# EAGLE design MEMS-preamp_v12 (EAGLE 8.5.0)

## Sheet 1 of 2
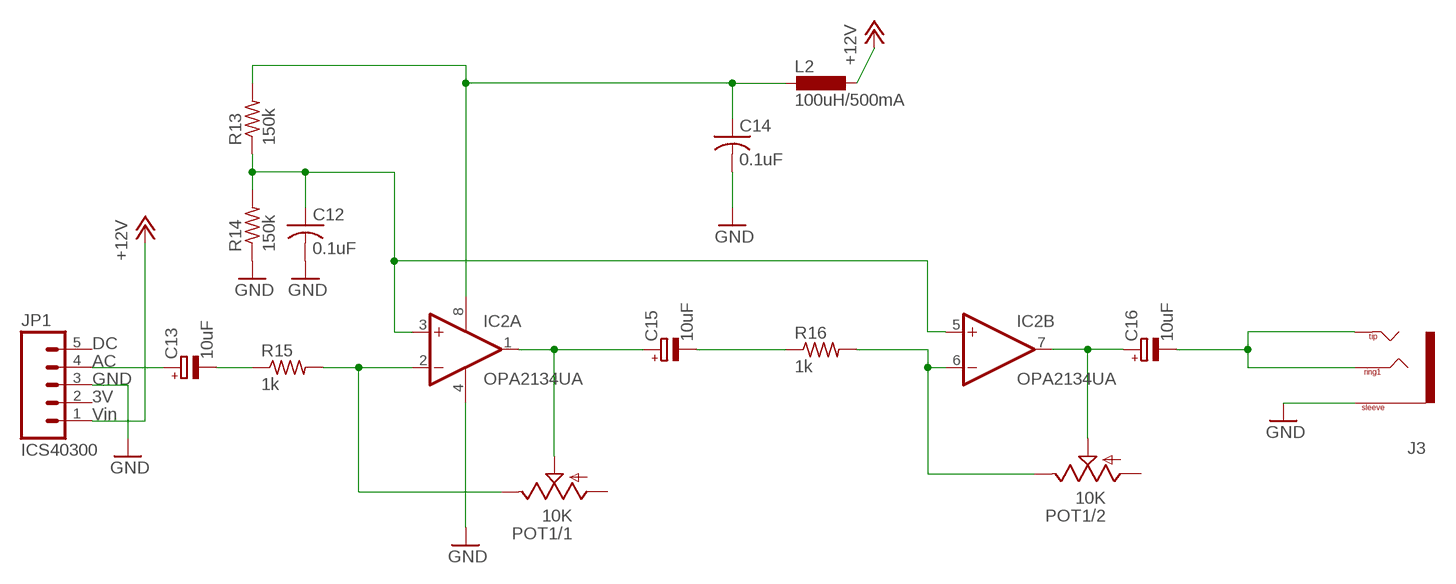
[diagram p0: schematic, sheet 1]

### Parts
C12  0.1uF  C-USC0805  [C0805]
C13  10uF  CPOL-EUB  [PANASONIC_B]
C14  0.1uF  C-USC0805K  [C0805K]
C15  10uF  CPOL-EUB  [PANASONIC_B]
C16  10uF  CPOL-EUB  [PANASONIC_B]
IC2  OPA2134UA  [SO08]
J3  TRS-1/8"-3.5MM  [TRS_SJ-3524-SMT]
JP1  ICS40300  M05LOCK  [1X05_LOCK]
L2  100uH/500mA  L-EUL3225M  [L3225M]
POT1  10K  POT-DUAL-PTV112-4420  [PTV112]
R13  150k  R-US_R0603  [R0603]
R14  150k  R-US_R0603  [R0603]
R15  1k  R-US_R0603  [R0603]
R16  1k  R-US_R0603  [R0603]

### Nets
+12V: JP1.1 L2.1 ; also sheet 2
GND: C12.2 C14.2 IC2.4(A:V-) J3.1(SLEEVE) JP1.3 R14.1 ; also sheet 2
N$3: C13.+ JP1.4
N$4: C15.- R16.1
N$5: IC2.2(A:-IN) POT1.1.3(/1:E) R15.2
N$7: C16.- J3.2(TIP) J3.3(RING1) J3.4(TIP)
N$8: C12.1 IC2.3(A:+IN) IC2.5(B:+IN) R13.1 R14.2
N$9: C15.+ IC2.1(A:OUT) POT1.1.2(/1:S)
N$10: C16.+ IC2.7(B:OUT) POT1.2.2(/2:S)
N$15: C14.1 IC2.8(A:V+) L2.2 R13.2
N$21: IC2.6(B:-IN) POT1.2.3(/2:E) R16.2
N$23: C13.- R15.1
Unconnected: JP1.2 JP1.5 POT1.1.1(/1:A) POT1.2.1(/2:A)

## Sheet 2 of 2
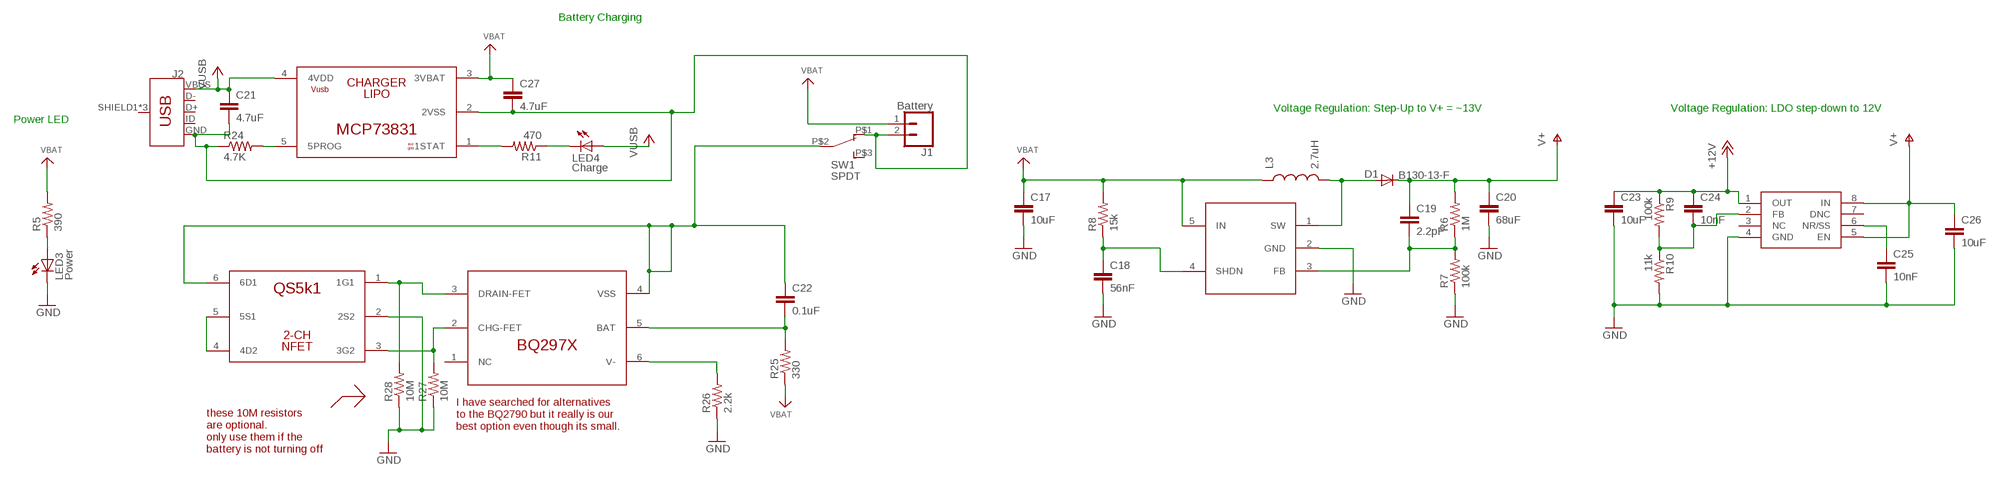
[diagram p1: schematic, sheet 2]

### Parts
C17  10uF  C-EUC0603  [C0603]
C18  56nF  C-EUC0603  [C0603]
C19  2.2pF  C-EUC0603  [C0603]
C20  68uF  C-EUC1206  [C1206]
C21  4.7uF  C-EUC0603  [C0603]
C22  0.1uF  C-EUC0603  [C0603]
C23  10uF  C-EUC0603  [C0603]
C24  10nF  C-EUC0603  [C0603]
C25  10nF  C-EUC0603  [C0603]
C26  10uF  C-EUC0603  [C0603]
C27  4.7uF  C-EUC0603  [C0603]
D1  B130-13-F  DIODESMA  [SMA-DIODE]
IC7  TPS7A49  [MSOP-8]
IC8  BQ297X  BQ297X-BATTERY-MANAGERLONG  [WSON-6-LONG]
IC9  SC4503  [SOT23-5]
IC10  MCP73831  [SOT-23-5]
IC11  QS6K1  [SOT457R_PHILIPS]
J1  Battery  CONN_02LOCK  [1X02_LOCK]
J2  USB_MICRO-BREDUCED_PASTE  [USB-B-MICRO-SMD_RED_PASTE]
L3  2.7uH  INDUCTORCR54  [CR54]
LED3  Power  LED3MM  [LED3MM]
LED4  Charge  LED3MM  [LED3MM]
R5  390  R-US_R0603  [R0603]
R6  1M  R-US_R0603  [R0603]
R7  100k  R-US_R0603  [R0603]
R8  15k  R-US_R0603  [R0603]
R9  100k  R-US_R0603  [R0603]
R10  11k  R-US_R0603  [R0603]
R11  470  R-US_R0603  [R0603]
R24  4.7K  R-US_R0603  [R0603]
R25  330  R-US_R0603  [R0603]
R26  2.2k  R-US_R0603  [R0603]
R27  10M  R-US_R0603  [R0603]
R28  10M  R-US_R0603  [R0603]
SW1  SPDT  SWITCH_SPDTCL-SB-12B  [SWITCH_SPDT_CL-SB-12B]

### Nets
+5V: C21.1 IC10.4(4VDD) J2.VBUS LED4.A ; supply symbol labelled VUSB
+12V: C23.1 C24.1 IC7.1(OUT) R9.1 ; also sheet 1
BATGND1: C22.1 IC8.4(VSS) IC11.6(6D1) SW1.P$2
GND: C17.2 C18.2 C20.2 C23.2 C25.2 C26.2 IC7.4(GND) IC9.2(GND) IC11.2(2S2) LED3.K(C) R7.1 R10.2 R26.1 R27.1 R28.1 ; also sheet 1
N$6: LED3.A R5.1
N$11: D1.A IC9.1(SW) L3.P$2
N$12: C18.1 IC9.4(SHDN) R8.1
N$13: C19.2 IC9.3(FB) R6.1 R7.2
N$14: C24.2 IC7.2(FB) R9.2 R10.1
N$16: C25.1 IC7.6(NR/SS)
N$17: LED4.K(C) R11.1
N$19: C22.2 IC8.5(BAT) R25.2
N$20: IC10.5(5PROG) R24.2
N$24: IC10.1(1STAT) R11.2
N$33: IC11.4(4D2) IC11.5(5S1)
N$35: IC8.3(DRAIN-FET) IC11.1(1G1) R28.2
N$36: IC8.2(CHG-FET) IC11.3(3G2) R27.2
N$37: IC8.6(V-) R26.2
USBGND1: C21.2 C27.2 IC10.2(2VSS) J1.2 J2.GND R24.1 SW1.P$1
V+: C19.1 C20.1 C26.1 D1.C IC7.5(EN) IC7.8(IN) R6.2
VBAT: C17.1 C27.1 IC9.5(IN) IC10.3(3VBAT) J1.1 L3.P$1 R5.2 R8.2 R25.1
Unconnected: IC7.3(NC) IC7.7(DNC) IC8.1(NC) J2.D+ J2.D- J2.ID J2.SHIELD1(SHIELD) J2.SHIELD2(SHIELD) J2.SHIELD3(SHIELD) SW1.P$3

### Notes on the sheet
- Battery Charging
- Voltage Regulation: Step-Up to V+ = ~13V | Voltage Regulation: LDO step-down to 12V
- Power LED
- I have searched for alternatives 
  to the BQ2790 but it really is our 
  best option even though its small.
- these 10M resistors
  are optional. 
  only use them if the 
  battery is not turning off

## Library data of the parts
C12 C14 = adafruit:C-US: CAPACITOR, American symbol
C13 C15 C16 = CMU-ArtFab:CPOL-EU: POLARIZED CAPACITOR, European symbol
C17-C27 = rcl:C-EU: CAPACITOR, European symbol; SPICEPREFIX: C
D1 = SparkFun:DIODE: Diode These are standard reverse protection diodes and small signal diodes. SMA package can handle up to about 1A. SOD-323 can handle about 200mA. What the SOD-323 package when ordering, there are some mfgs out there that are 5-pin packages.
IC2 = linear:OPA2*: Dual Operational Amplifier Low Power, Single-Supply, Rail-To-Rail Operational Amplifier Source: http://focus.ti.com/lit/ds/symlink/opa2345.pdf http://focus.ti.com .. opa241.pdf http://focus.ti.com/lit/ds/symlink/opa2134.pdf
IC7 = CMU-ArtFab:TPS7A49
IC8 = CMU-ArtFab:BQ297X-BATTERY-MANAGER
IC9 = CMU-ArtFab:SC4503
IC10 = CMU-ArtFab:MCP73831
IC11 = CMU-ArtFab:QS6K1
J1 = SparkFun-Connectors:CONN_02: Multi connection point. Often used as Generic Header-pin footprint for 0.1 inch spaced/style header connections On any of the 0.1 inch spaced packages, you can populate with these: Break Away Headers - Straight <https://www.sparkfun.com/products/116> (PRT-00116) Break Away Male Headers - Right Angle <https://www.sparkfun.com/products/553> (PRT-00553) Female Headers <https://www.sparkfun.com/products/115> (PRT-00115) Break Away Headers - Machine Pin <https://www.sparkfun.com/products/117> (PRT-00117) Break Away Female Headers - Swiss Machine Pin <https://www.sparkfun.com/products/743> (PRT-00743) For SCREWTERMINALS and SPRING TERMINALS visit here: Screw Terimnals on SparkFun.com <https://www.sparkfun.com/search/results?term=Screw+Terminals> (5mm/3.5mm/2.54mm spacing) This device is also useful as a general connection point to wire up your design to another part of your project. Our various solder wires solder well into these plated through hole pads. Hook-Up Wire - Assortment (Stranded, 22 AWG) <https://www.sparkfun.com/products/11375> (PRT-11375) Hook-Up Wire - Assortment (Solid Core, 22 AWG) <https://www.sparkfun.com/products/11367> (PRT-11367) View the entire wire category on our website here <https://www.sparkfun.com/categories/141> Special notes: Molex polarized connector foot print use with: PRT-08233 with associated crimp pins and housings. 2.54_SCREWTERM for use with PRT-10571. 3.5mm Screw Terminal footprints for PRT-08084 5mm Screw Terminal footprints for use with PRT-08432
J2 = CMU-ArtFab:USB_MICRO-B: USB Type Micro-B Connector Male/female and PTH/SMT variants SparkFun Products: SparkFun microB USB Breakout <https://www.sparkfun.com/products/12035> SparkFun USB microB Plug Breakout <https://www.sparkfun.com/products/10031> SparkFun ESP8266 Thing <https://www.sparkfun.com/products/13231>; PROD_ID: CONN-11752
J3 = CMU-ArtFab:TRS-1/8"-3.5MM
JP1 = SparkFun-Connectors:M05: Header 5 Standard 5-pin 0.1" header. Use with straight break away headers (SKU : PRT-00116), right angle break away headers (PRT-00553), swiss pins (PRT-00743), machine pins (PRT-00117), and female headers (PRT-00115). Molex polarized connector foot print use with SKU : PRT-08230 with associated crimp pins and housings.; CON1: Vin; CON2: 3V; CON3: GND; CON4: AC; CON5: DC
L2 = rcl:L-EU: INDUCTOR, European symbol; SPICEPREFIX: L
L3 = SparkFun-Passives:INDUCTOR: Inductors Basic Inductor/Choke - 0603 and 1206. Footprints are not proven and vary greatly between part numbers. SRN6045- 33uH, 20% 1.4A SDR0403-560KL - 56uH, 10%, 500mA RMS/740mA peak
LED3 LED4 = led:LED: LED OSRAM: - CHIPLED LG R971, LG N971, LY N971, LG Q971, LY Q971, LO R971, LY R971 LH N974, LH R974 LS Q976, LO Q976, LY Q976 LO Q996 - Hyper CHIPLED LW Q18S LB Q993, LB Q99A, LB R99A - SideLED LS A670, LO A670, LY A670, LG A670, LP A670 LB A673, LV A673, LT A673, LW A673 LH A674 LY A675 LS A676, LA A676, LO A676, LY A676, LW A676 LS A679, LY A679, LG A679 - Hyper Micro SIDELED® LS Y876, LA Y876, LO Y876, LY Y876 LT Y87S - SmartLED LW L88C, LW L88S LB L89C, LB L89S, LG L890 LS L89K, LO L89K, LY L89K LS L896, LA L896, LO L896, LY L896 - TOPLED LS T670, LO T670, LY T670, LG T670, LP T670 LSG T670, LSP T670, LSY T670, LOP T670, LYG T670 LG T671, LOG T671, LSG T671 LB T673, LV T673, LT T673, LW T673 LH T674 LS T676, LA T676, LO T676, LY T676, LB T676, LH T676, LSB T676, LW T676 LB T67C, LV T67C, LT T67C, LS T67K, LO T67K, LY T67K, LW E67C LS E67B, LA E67B, LO E67B, LY E67B, LB E67C, LV E67C, LT E67C LW T67C LS T679, LY T679, LG T679 LS T770, LO T770, LY T770, LG T770, LP T770 LB T773, LV T773, LT T773, LW T773 LH T774 LS E675, LA E675, LY E675, LS T675 LS T776, LA T776, LO T776, LY T776, LB T776 LHGB T686 LT T68C, LB T68C - Hyper Mini TOPLED® LB M676 - Mini TOPLED Santana® LG M470 LS M47K, LO M47K, LY M47K Source: http://www.osram.convergy.de LUXEON: - LUMILED® LXK2-PW12-R00, LXK2-PW12-S00, LXK2-PW14-U00, LXK2-PW14-V00 LXK2-PM12-R00, LXK2-PM12-S00, LXK2-PM14-U00 LXK2-PE12-Q00, LXK2-PE12-R00, LXK2-PE12-S00, LXK2-PE14-T00, LXK2-PE14-U00 LXK2-PB12-K00, LXK2-PB12-L00, LXK2-PB12-M00, LXK2-PB14-N00, LXK2-PB14-P00, LXK2-PB14-Q00 LXK2-PR12-L00, LXK2-PR12-M00, LXK2-PR14-Q00, LXK2-PR14-R00 LXK2-PD12-Q00, LXK2-PD12-R00, LXK2-PD12-S00 LXK2-PH12-R00, LXK2-PH12-S00 LXK2-PL12-P00, LXK2-PL12-Q00, LXK2-PL12-R00 Source: www.luxeon.com KINGBRIGHT: KA-3528ASYC Source: www.kingbright.com
POT1 = CMU-ArtFab:POT-DUAL-PTV112: Bourns 11mm dual potentiometer; AVAILABILITY: Unavailable; DESCRIPTION: Alt# Tce-10111410; MF: STMicroelectronics; MP: PTV112; PACKAGE: None; PRICE: None
R5-R11 R13-R16 R24-R28 = CMU-ArtFab:R-US_: RESISTOR, American symbol
SW1 = CMU-ArtFab:SWITCH_SPDT

## Board
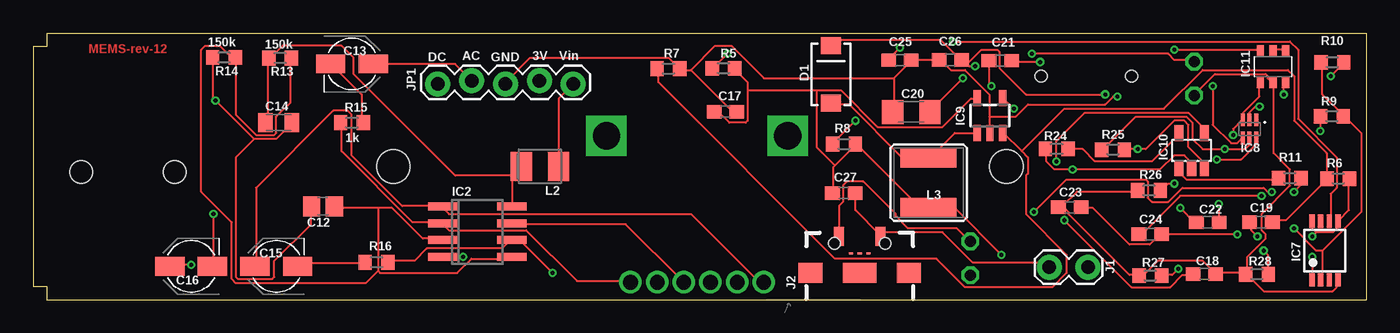
[diagram p2: board, top side]
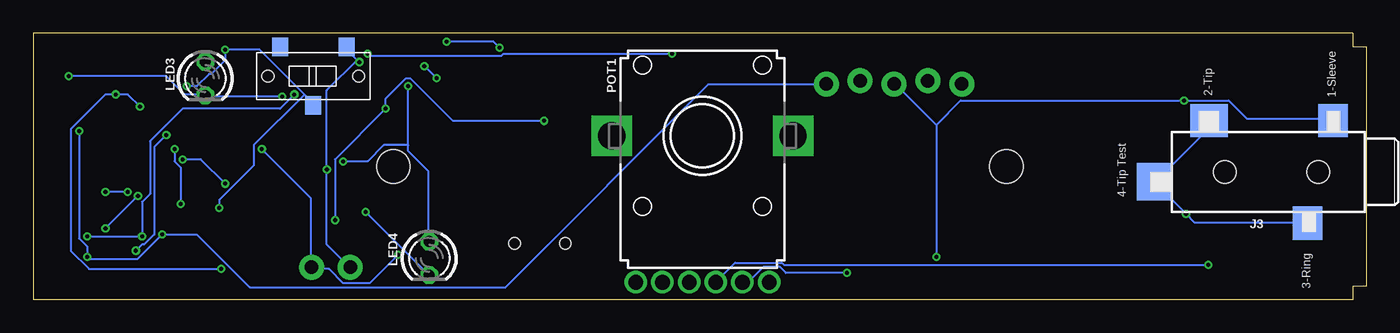
[diagram p3: board, bottom side, seen from below]

Size 100 x 20 mm. Coordinates in mm from the lower left corner, seen from the top.
Outline: 0,19 0,1 1.02,1 1,0 100,0 100,20 1,20 1,19 0,19
Copper layers (1*16): Top 0.035mm / dielectric 1.5mm / Bottom 0.035mm
Design rules "SeeedStudio_2layer_DRU_no_angle_20140221": minimum track width 6mil, minimum drill 12mil, track to track 6mil, track to pad 6mil, pad to pad 6mil, via to via 6mil, smd to smd 0mil, copper to edge 10mil, drill to drill 10mil, minimum pad ring 10mil, minimum via ring 6mil, stop-mask expansion 2mil, vias tented up to drill 100mil, thermal gap 10mil
Holes 2.5 mm at 73,10 27,10

### Footprints (pad centres in the part's own frame; a part is rotated, then mirrored left to right if it is on the bottom)
C0805 = smd 1.3 x 1.5: 1 -0.85,0; 2 0.85,0
PANASONIC_B = smd 2.2 x 1.4: + 1.6,0; - -1.6,0
C0805K = smd 1.1 x 1.4: 1 -1,0; 2 1,0
C0603 = smd 1.1 x 1: 1 -0.85,0; 2 0.85,0
C1206 = smd 1.6 x 1.8: 1 -1.4,0; 2 1.4,0
SMA-DIODE = smd 1.27 x 1.47: A -2.15,0; C 2.15,0
SO08 = smd 0.6 x 2.2: 1 -1.905,-2.6; 2 -0.635,-2.6; 3 0.635,-2.6; 4 1.905,-2.6; 5 1.905,2.6; 6 0.635,2.6; 7 -0.635,2.6; 8 -1.905,2.6
MSOP-8 = smd 0.4 x 1: 1 -0.975,-2.2; 2 -0.325,-2.2; 3 0.325,-2.2; 4 0.975,-2.2; 5 0.975,2.2; 6 0.325,2.2; 7 -0.325,2.2; 8 -0.975,2.2
WSON-6-LONG = smd 0.3 x 0.954: 1 -0.5,-0.686; 2 0,-0.686; 3 0.5,-0.686; 4 0.5,0.686; 5 0,0.686; 6 -0.5,0.686
SOT23-5 = smd 0.55 x 1.2: 1 -0.95,-1.3; 2 0,-1.3; 3 0.95,-1.3; 4 0.95,1.3; 5 -0.95,1.3
SOT-23-5 = smd 0.69 x 1.2: 1 -0.95,-1.3; 2 0,-1.3; 3 0.95,-1.3; 4 0.95,1.3; 5 -0.95,1.3
SOT457R_PHILIPS = smd 0.55 x 0.8: 1 -0.95,-1.2; 2 0,-1.2; 3 0.95,-1.2; 4 0.95,1.2; 5 0,1.2; 6 -0.95,1.2
1X02_LOCK = drill 1.016 pad 1.88: 1 -0.178,0; 2 2.718,0
USB-B-MICRO-SMD_RED_PASTE = smd 0.152 x 0.305: D+ 1.455,0; D- 1.455,0.65; ID 1.455,-0.65 | smd 1.45 x 0.762: GND 2.725,-1.554 | smd 1.5 x 1.8: SHIELD1 0,3.685; SHIELD2 0,-3.685 | smd 1.5 x 2.5: SHIELD3 0,0 | smd 1.45 x 0.781: VBUS 2.725,1.554 | hole 0.85: 2.2,1.9; 2.2,-1.9
TRS_SJ-3524-SMT = smd 2.5 x 2.2: 1 3.85,-4.6; 3 -3.85,-2.7 | smd 2.5 x 2.8: 2 3.85,4.7 | smd 2.8 x 2.5: 4 -0.75,8.85 | hole 1.7: 0,-3.5; 0,3.5
1X05_LOCK = drill 1.016 pad 1.88: 1 0,0.127; 2 2.54,-0.127; 3 5.08,0.127; 4 7.62,-0.127; 5 10.16,0.127
L3225M = smd 1.6 x 2.2: 1 -1.4,0; 2 1.4,0
CR54 = smd 4.2 x 1.4: P$1 0,1.85; P$2 0,-1.85
LED3MM = drill 0.813 octagon: A -1.27,0; K 1.27,0
PTV112 = drill 1.1 pad 1.676: 1.1 -3,-11; 1.2 -5,-11; 1.3 5,-11; 2.1 -1,-11; 2.2 1,-11; 2.3 3,-11 | drill 2.032 pad 2.8 square: M1 -6.8,0; M2 6.8,0
R0603 = smd 1 x 1.1: 1 -0.85,0; 2 0.85,0
SWITCH_SPDT_CL-SB-12B = smd 1.2 x 1.4: P$1 -2.5,-2.2; P$2 0,2.2; P$3 2.5,-2.2 | hole 0.9: -3.4,0; 3.4,0

### Placement (x,y rotation side)
C12  21.73,7 180 top
C13  23.9,17.7 0 top
C14  18.4,13.3 0 top
C15  18.23,2.49 180 top
C16  11.85,2.5 180 top
C17  51.93,14.11 0 top
C18  87.86,1.92 0 top
C19  92.11,5.81 0 top
C20  65.87,14.1 180 top
C21  72.54,17.94 0 top
C22  88.1,5.8 0 top
C23  77.75,6.93 180 top
C24  83.79,4.92 180 top
C25  65.02,17.98 0 top
C26  68.8,18 180 top
C27  60.8,8 0 top
D1  59.84,16.91 90 top
IC2  33.3,5.1 270 top
IC7  96.91,3.68 0 top
IC8  91.25,12.81 180 top
IC9  71.77,13.82 0 top
IC10  86.9,11.2 0 top
IC11  93,17.5 0 top
J1  78.95,2.44 180 top
J2  62,2.02 90 top
J3  7.1,9.6 90 bottom
JP1  40.51,16.32 180 top
L2  38,10 180 top
L3  67.17,8.79 180 top
LED3  87.1,16.6 270 bottom
LED4  70.3,3.1 270 bottom
POT1  49.8,12.3 0 bottom
R5  51.78,17.37 0 top
R6  97.91,9.09 0 top
R7  47.65,17.34 180 top
R8  60.83,11.68 0 top
R9  97.44,13.77 0 top
R10  97.47,17.82 0 top
R11  94.26,9.12 180 top
R13  18.51,18.14 180 top
R14  14.31,18.18 0 top
R15  23.9,13.29 180 top
R16  25.74,2.79 0 top
R24  76.78,11.32 0 top
R25  81.01,11.26 180 top
R26  83.7,8.2 0 top
R27  83.8,1.8 0 top
R28  91.8,1.9 0 top
SW1  79,16.78 180 bottom

### Tracks (layer width: path | path; a pad name or v marks a point on that pad's centre or on a via)
+5V  (via drill 0.3)
  Top 0.152: v71.88,16.02 71.73,16.17 71.73,17.85 C21.1 | v76.76,10.38 76.76,11.9 78.89,14.04 86.66,14.04 87.73,12.97 87.73,12.51 IC10.4 | J2.VBUS 60.45,4.89 60.45,7.03 60.76,7.33 60.76,8.55 61.06,8.86 62.28,8.86 64.72,6.42 64.72,6.27 65.63,5.35 69.29,5.35 70.21,4.44 LED4.A
  Bottom 0.152: 71.88,11.6 71.88,11.14 70.36,9.62 70.36,4.44 LED4.A | 71.88,11.6 v71.88,16.02 | v76.76,10.38 74.93,10.38 73.71,11.6 71.88,11.6
+12V  (via drill 0.3)
  Top 0.152: L2.1 39.42,10.07 39.42,15.1 40.49,16.17 JP1.1 | C23.1 78.74,6.88 79.5,6.88 82.24,4.13 83.77,4.13 84.53,4.89 C24.1 84.68,4.89 v90.32,4.89 | v95.96,3.22 95.96,1.54 IC7.1 | v96.57,12.67 96.57,13.73 R9.1
  Bottom 0.152: v96.57,12.67 96.57,4.59 95.96,3.98 v95.96,3.22 95.81,3.06 92.15,3.06 v90.32,4.89 87.73,4.89 83.77,0.93 64.57,0.93 49.33,16.17 40.64,16.17 JP1.1
BATGND1  (via drill 0.3)
  Top 0.152: v85.6,18.76 92,18.76 IC11.6 | v88.49,16.02 88.49,13.12 89.86,11.75 90.32,11.75 90.63,12.06 IC8.4 | v86.05,6.88 87.12,5.81 C22.1
  Bottom 0.152: 79.65,15.41 78.89,14.65 SW1.P$2 | 79.65,15.41 83.01,18.76 v85.6,18.76 85.6,18 86.66,16.93 86.82,16.93 87.73,16.02 v88.49,16.02 | v86.05,6.88 86.05,7.48 83.46,10.07 83.46,11.6 79.65,15.41
GND  (via drill 0.3)
  Top 0.152: LED3.K 87.12,15.41 88.65,16.93 92.46,16.93 92.61,16.78 92.61,16.63 92.91,16.32 IC11.2 93.06,16.17 93.06,10.99 94.28,9.77 94.28,8.55 92.15,6.42 92.15,5.2 92.46,4.89 92.46,4.59 91.08,3.22 91.08,2 R28.1 | v97.33,16.78 98.25,17.7 R10.2 | 77.22,7.03 76.91,7.03 C23.2 77.22,7.03 | 77.22,7.03 78.28,8.09 82.7,8.09 R26.1 | IC7.4 97.79,1.39 97.79,0.93 97.48,0.63 92.3,0.63 91.08,1.85 R28.1 | R28.1 90.93,2 88.8,2 C18.2 88.65,2 87.73,2.91 84.38,2.91 83.31,1.85 83.01,1.85 R27.1 82.85,1.85 82.24,1.85 77.67,6.42 77.67,6.57 77.22,7.03 | 16.56,12.06 v13.66,14.95 13.51,15.1 13.51,18.15 R14.1 | 16.56,12.06 18.24,12.06 19.46,13.28 C14.2 | 16.56,12.06 15.19,10.68 15.19,1.69 15.34,1.54 17.93,1.54 18.08,1.69 18.08,2.91 20.83,5.66 20.83,6.88 C12.2 | 71.73,13.73 71.73,15.41 69.9,17.24 68.83,17.24 68.07,18 C26.2 65.94,18 C25.2 65.79,17.85 64.57,16.63 | 71.73,13.73 71.73,12.67 IC9.2 | 64.57,16.63 64.57,14.19 C20.2 | 49.33,17.24 52.37,14.19 52.68,14.19 C17.2 | 49.33,17.24 48.56,17.24 R7.1 48.41,17.39 47.65,18.15 37.29,18.15 35.46,16.32 JP1.3 | v32.26,3.22 30.73,3.22 IC2.4 | 64.57,16.63 54.81,16.63 52.37,19.07 51.16,19.07 49.33,17.24 | v81.33,15.26 81.03,15.26 80.42,14.65 74.62,14.65 73.71,13.73 71.73,13.73
  Bottom 0.152: v97.33,16.78 90.02,16.78 88.65,15.41 87.12,15.41 LED3.K 86.97,15.26 v81.33,15.26 | 32.26,13.12 v32.26,3.22 | 32.26,13.12 35.31,16.17 JP1.3 | 32.26,13.12 30.43,14.95 v13.66,14.95 10.31,14.95 8.94,13.58 2.54,13.58 J3.1
N$3
  Top 0.152: C13.+ 25.55,17.7 31.65,17.7 32.87,16.48 JP1.4
N$4
  Top 0.152: R16.1 24.79,2.76 20.07,2.76 19.91,2.61 C15.-
N$5
  Top 0.152: R15.2 23.11,13.28 23.11,11.14 28.45,5.81 30.58,5.81 IC2.2 30.73,5.66 31.19,5.2 36.98,5.2 40.79,1.39 44.75,1.39 POT1.1.3
N$6  (via drill 0.3)
  Top 0.152: v52.07,18.46 51,17.39 R5.1 | v74.93,18.46 85.14,18.46 85.6,18 86.97,18 LED3.A
  Bottom 0.152: v52.07,18.46 64.72,18.46 64.87,18.3 74.78,18.3 v74.93,18.46
N$7  (via drill 0.3)
  Top 0.152: v13.51,6.42 13.51,2.61 C16.-
  Bottom 0.152: J3.3 4.52,5.81 12.9,5.81 v13.51,6.42 15.8,8.7 J3.4 15.8,8.86 11.84,12.82 11.84,13.43 J3.2
N$8
  Top 0.152: R13.1 19.3,18 19.3,14.8 18.24,13.73 18.24,12.51 18.08,12.36 16.71,12.36 15.19,13.88 15.19,18.15 R14.2 15.04,18.3 14.73,18.3 13.97,19.07 12.9,19.07 12.6,18.76 12.6,8.09 14.88,5.81 14.88,1.54 15.19,1.24 24.94,1.24 25.86,2.15 | 25.86,6.88 26.92,6.88 29.21,4.59 30.58,4.59 IC2.3 | 25.86,6.88 22.66,6.88 C12.1 | 25.86,2.15 26.01,2 31.8,2 32.87,3.06 35.76,3.06 IC2.5 | 25.86,6.88 25.86,2.15
N$9
  Top 0.152: C15.+ 16.71,2.61 16.71,8.4 22.5,14.19 23.57,14.19 23.88,13.88 23.88,10.84 27.69,7.03 30.58,7.03 IC2.1 30.73,6.88 31.19,6.42 49.33,6.42 54.36,1.39 54.66,1.39 POT1.1.2
N$10  (via drill 0.3)
  Top 0.152: v11.84,2.61 10.31,2.61 C16.+ | IC2.7 35.92,5.66 44.45,5.66 48.72,1.39 POT1.2.2
  Bottom 0.152: v11.84,2.61 43.69,2.61 43.84,2.76 47.35,2.76 48.72,1.39 POT1.2.2
N$11
  Top 0.152: IC9.1 69.14,12.51 67.31,10.68 L3.P$2 67.16,10.68 65.18,10.68 61.21,14.65 59.84,14.65 D1.A
N$12  (via drill 0.3)
  Top 0.152: v77.37,5.96 82.4,0.93 85.29,0.93 86.21,1.85 86.97,1.85 C18.1 | v73.56,14.34 72.8,15.1 IC9.4 | v61.67,13.43 59.99,11.75 R8.1
  Bottom 0.152: v77.37,5.96 77.37,10.53 v73.56,14.34 73.56,15.1 72.03,16.63 71.73,16.63 68.53,13.43 v61.67,13.43
N$13
  Top 0.152: C19.2 93.06,5.96 93.98,5.96 97.03,9.01 R6.1 97.03,9.16 97.03,10.99 94.59,13.43 94.59,16.78 94.13,17.24 87.73,17.24 84.84,14.34 77.37,14.34 74.17,11.14 | 74.17,11.14 72.8,12.51 IC9.3 | 74.17,11.14 74.62,10.68 74.62,9.47 74.47,9.31 74.47,6.42 77.52,3.37 77.52,2 76.45,0.93 69.9,0.93 67.77,3.06 60.15,3.06 46.89,16.32 46.89,17.24 R7.2
N$14  (via drill 0.3)
  Top 0.152: 96.72,3.67 96.72,1.54 IC7.2 | 96.72,3.67 99.62,6.57 99.62,12.51 98.4,13.73 R9.2 98.25,13.88 96.72,15.41 96.72,17.7 R10.1 | v92.15,7.79 86.05,7.79 83.31,5.05 83.01,5.05 C24.2 | v94.59,5.35 96.27,3.67 96.72,3.67
  Bottom 0.152: v94.59,5.35 v92.15,7.79
N$15
  Top 0.152: C14.1 17.47,13.43 17.63,13.58 17.63,18 R13.2 17.78,18.15 18.69,19.07 23.11,19.07 24.03,18.15 24.03,16.93 31.65,9.31 35.92,9.31 | 35.92,9.31 35.92,7.03 IC2.8 | 35.92,9.31 36.52,9.92 L2.2 35.92,9.31
N$16  (via drill 0.3)
  Top 0.152: v68.99,19.37 94.28,19.37 94.89,18.76 94.89,13.58 97.79,10.68 97.79,8.4 97.33,7.94 97.33,5.96 IC7.6 | v65.02,18.91 64.11,18 C25.1
  Bottom 0.152: v68.99,19.37 65.48,19.37 v65.02,18.91
N$17  (via drill 0.3)
  Top 0.152: v94.59,8.09 95.05,8.55 95.05,9.01 R11.1 | v92.91,8.09 92.61,8.09 92.3,8.4 86.21,8.4 85.14,7.33 83.92,7.33 83.62,7.64 83.62,8.86 83.46,9.01 77.52,9.01 v75.08,6.57
  Bottom 0.152: v92.91,8.09 v94.59,8.09 | v75.08,6.57 70.36,1.85 LED4.K
N$19  (via drill 0.3)
  Top 0.152: IC8.5 91.24,12.06 91.24,11.6 90.93,11.29 v89.41,11.29 87.73,11.29 86.97,12.06 86.97,13.28 86.51,13.73 82.7,13.73 80.26,11.29 R25.2 | v88.95,7.18 C22.2
  Bottom 0.152: v88.95,7.18 88.95,9.92 89.41,10.38 v89.41,11.29
N$20
  Top 0.152: R24.2 77.67,11.29 78.74,11.29 79.65,10.38 83.92,10.38 85.9,12.36 IC10.5
N$21  (via drill 0.3)
  Top 0.152: R16.2 26.62,2.91 28.6,2.91 29.51,3.83 35.15,3.83 35.76,4.44 IC2.6 35.92,4.44 36.52,4.44 v38.96,2
  Bottom 0.152: v38.96,2 43.54,2 43.99,2.46 45.21,2.46 46.28,1.39 46.74,1.39 POT1.2.3
N$23
  Top 0.152: R15.1 24.64,13.43 24.64,15.41 22.35,17.7 C13.-
N$24
  Top 0.152: R11.2 93.37,9.01 86.51,9.01 86.05,9.47 86.05,9.77 IC10.1
N$33
  Top 0.152: IC11.5 93.06,18.76 93.83,18.76 IC11.4
N$35  (via drill 0.3)
  Top 0.152: IC11.1 92,16.17 92,15.26 90.78,14.04 90.78,13.58 IC8.3 90.63,13.43 90.02,12.82 v90.02,12.36 | v92.3,3.67 92.61,3.37 92.61,2 R28.2
  Bottom 0.152: v92.3,3.67 91.85,4.13 91.69,4.13 90.93,4.89 90.93,11.45 v90.02,12.36
N$36  (via drill 0.3)
  Top 0.152: v93.83,15.41 93.83,16.17 IC11.3 | v92,14.5 91.69,14.5 91.24,14.04 91.24,13.58 IC8.2 | v85.9,2.3 85.45,1.85 84.68,1.85 R27.2
  Bottom 0.152: v92,14.5 92.91,15.41 v93.83,15.41 94.59,15.41 97.18,12.82 97.18,3.67 95.81,2.3 v85.9,2.3
N$37  (via drill 0.3)
  Top 0.152: v88.8,10.53 90.63,10.53 91.69,11.6 91.69,12.06 IC8.6 | v85.6,8.7 85.14,8.7 84.68,8.25 R26.2
  Bottom 0.152: v88.8,10.53 87.43,10.53 v85.6,8.7
USBGND1  (via drill 0.3)
  Top 0.152: R24.1 76,11.29 76,10.38 76.61,9.77 v77.98,9.77 84.53,9.77 85.6,10.84 86.36,10.84 86.82,10.38 86.82,9.92 IC10.2 | 63.5,4.89 61.67,6.72 61.67,7.94 C27.2 | v75.54,17.85 73.41,17.85 C21.2 | 63.5,4.89 63.65,5.05 68.22,5.05 70.51,2.76 75.84,2.76 76.15,2.46 J1.2 | 63.5,4.89 J2.GND
  Bottom 0.152: 75.69,18 76.61,18.91 SW1.P$1 | 75.69,18 77.98,15.71 v77.98,9.77 77.98,4.13 76.3,2.46 J1.2 | 75.69,18 v75.54,17.85
V+  (via drill 0.3)
  Top 0.152: 96.27,5.05 95.96,5.35 95.96,5.81 IC7.8 | 96.27,5.05 97.48,5.05 97.79,5.35 97.79,5.81 IC7.5 97.94,5.96 98.7,6.72 98.7,9.01 R6.2 | v91.85,4.74 91.39,5.2 91.39,5.81 C19.1 | 96.27,5.05 v95.96,4.74 | C26.1 69.59,18 68.07,19.52 60.3,19.52 59.84,19.07 D1.C | v69.75,16.63 67.31,14.19 C20.1 | v70.66,17.54 70.21,17.54 70.05,17.7 | 70.05,17.7 69.75,18 C26.1 | v80.42,15.41 74.47,15.41 72.49,17.39 72.49,18.61 72.34,18.76 71.12,18.76 70.05,17.7 | 70.05,17.7 C26.1
  Bottom 0.152: v95.96,4.74 v91.85,4.74 91.85,7.33 91.24,7.94 91.24,11.9 88.8,14.34 81.48,14.34 v80.42,15.41 | v70.66,17.54 v69.75,16.63
VBAT  (via drill 0.3)
  Top 0.152: R25.1 81.94,11.29 v82.85,11.29 83.46,11.29 85.6,13.43 86.36,13.43 86.66,13.12 86.66,11.45 87.73,10.38 87.73,9.92 IC10.3 | 60.15,10.07 61.67,11.6 R8.2 61.82,11.6 66.4,7.03 67.16,7.03 L3.P$1 67.31,6.88 69.14,6.88 v72.64,3.37 | 60.15,10.07 59.99,9.92 59.99,8.09 C27.1 | 53.59,15.71 53.59,16.32 52.68,17.24 R5.2 | 53.59,15.71 53.59,13.43 53.44,13.28 52.22,13.28 51.46,14.04 51.16,14.04 C17.1 | 53.59,15.71 58.78,15.71 | 58.78,15.71 60.6,15.71 63.35,12.97 68.22,12.97 70.36,15.1 70.81,15.1 IC9.5 | 60.15,10.07 58.78,11.45 58.78,15.71
  Bottom 0.152: v82.85,11.29 79.2,7.64 79.2,2.46 J1.1 79.04,2.3 77.83,2.3 76.76,1.24 74.78,1.24 v72.64,3.37

### Text on the board
Top: MEMS-rev-12